# Altium schematic sheet 7688A-kit-V2-2.SchDoc
size A4
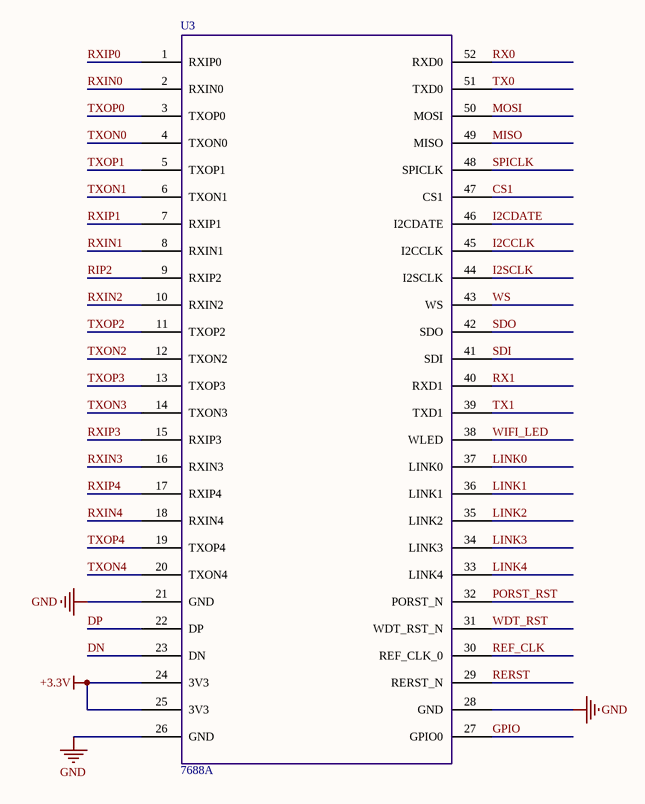
[diagram p0: 7688A-kit-V2-2.SchDoc]

## Parts
U3  7688A  [RM08K_52pin]

## Nets
+3.3V: U3.24(3V3) U3.25(3V3)
GND: U3.21(GND) U3.26(GND) U3.28(GND)
CS1: U3.47(CS1)
DN: U3.23(DN)
DP: U3.22(DP)
GPIO: U3.27(GPIO0)
I2CCLK: U3.45(I2CCLK)
I2CDATE: U3.46(I2CDATE)
I2SCLK: U3.44(I2SCLK)
LINK0: U3.37(LINK0)
LINK1: U3.36(LINK1)
LINK2: U3.35(LINK2)
LINK3: U3.34(LINK3)
LINK4: U3.33(LINK4)
MISO: U3.49(MISO)
MOSI: U3.50(MOSI)
PORST_RST: U3.32(PORST_N)
REF_CLK: U3.30(REF_CLK_0)
RERST: U3.29(RERST_N)
RIP2: U3.9(RXIP2)
RX0: U3.52(RXD0)
RX1: U3.40(RXD1)
RXIN0: U3.2(RXIN0)
RXIN1: U3.8(RXIN1)
RXIN2: U3.10(RXIN2)
RXIN3: U3.16(RXIN3)
RXIN4: U3.18(RXIN4)
RXIP0: U3.1(RXIP0)
RXIP1: U3.7(RXIP1)
RXIP3: U3.15(RXIP3)
RXIP4: U3.17(RXIP4)
SDI: U3.41(SDI)
SDO: U3.42(SDO)
SPICLK: U3.48(SPICLK)
TX0: U3.51(TXD0)
TX1: U3.39(TXD1)
TXON0: U3.4(TXON0)
TXON1: U3.6(TXON1)
TXON2: U3.12(TXON2)
TXON3: U3.14(TXON3)
TXON4: U3.20(TXON4)
TXOP0: U3.3(TXOP0)
TXOP1: U3.5(TXOP1)
TXOP2: U3.11(TXOP2)
TXOP3: U3.13(TXOP3)
TXOP4: U3.19(TXOP4)
WDT_RST: U3.31(WDT_RST_N)
WIFI_LED: U3.38(WLED)
WS: U3.43(WS)

## Library data of the parts
U3 = Component_1